# EAGLE design USB (EAGLE 4.16)
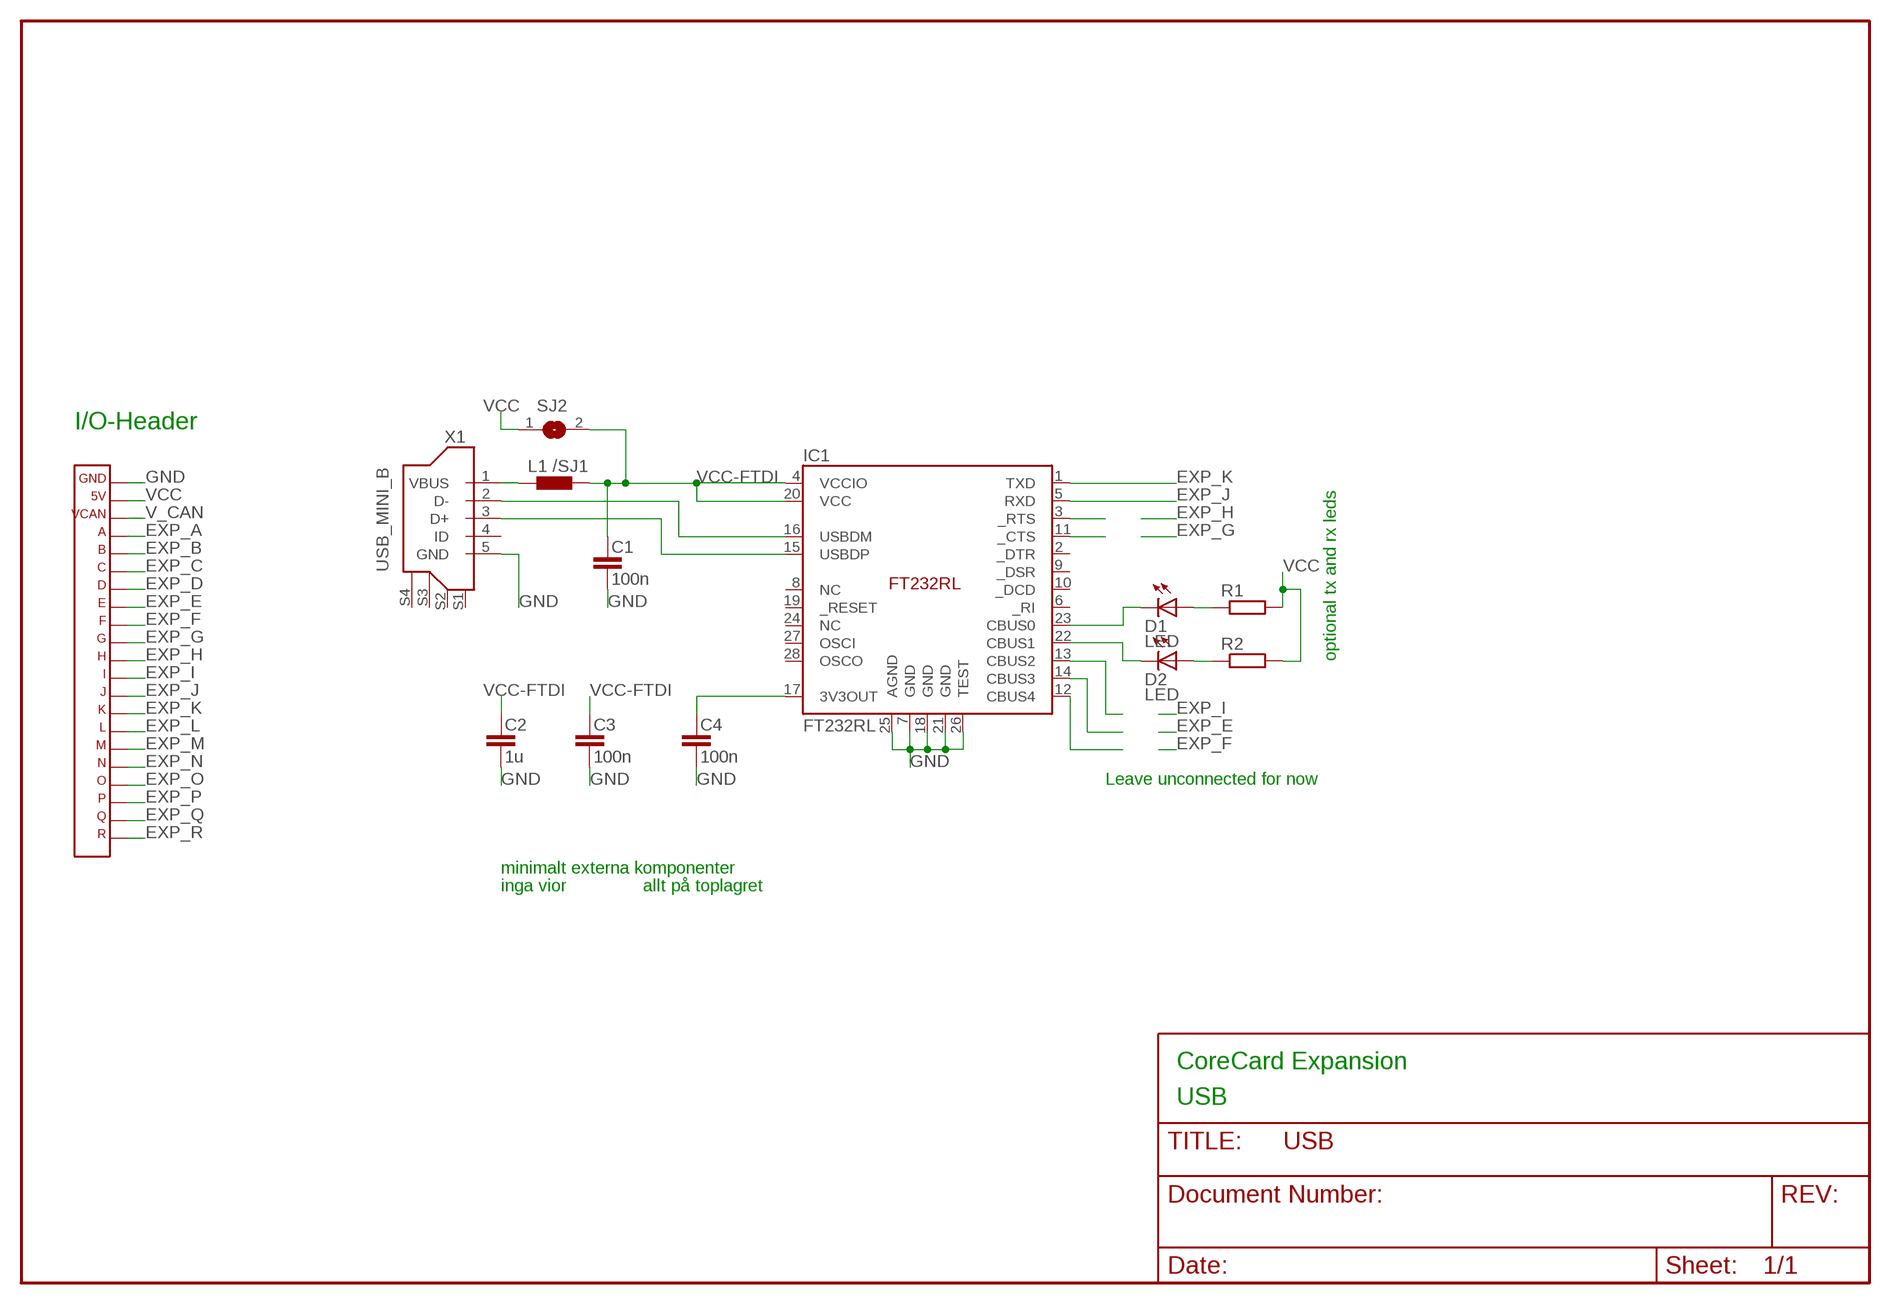
[diagram p0: schematic, sheet 1]

## Parts
C1  100n  C-EU  [C0603]
C2  1u  C-EU  [C0603]
C3  100n  C-EU  [C0603]
C4  100n  C-EU  [C0603]
D1  LED  [0603]
D2  LED  [0603]
IC1  FT232RL  [SSOP-28]
L1  L-EUL0603  [L0603]
R1  R-EUR0603  [R0603]
R2  R-EUR0603  [R0603]
SJ2  SJ_NO  [SJ_NO]
X1  USB_MINI_B  [MOLEX67503]
X3  CORE_IOHEADEXP  [CORE_IOHEAD_NOSILC]

## Nets
D+: IC1.15(USBDP) X1.3(D+)
D-: IC1.16(USBDM) X1.2(D-)
EXP_A: X3.4
EXP_B: X3.5
EXP_C: X3.6
EXP_D: X3.7
EXP_E: X3.8
EXP_F: X3.9
EXP_G: X3.10
EXP_H: X3.11
EXP_I: X3.12
EXP_J: IC1.5(RXD) X3.13
EXP_K: IC1.1(TXD) X3.14
EXP_L: X3.15
EXP_M: X3.16
EXP_N: X3.17
EXP_O: X3.18
EXP_P: X3.19
EXP_Q: X3.20
EXP_R: X3.21
GND: C1.2 C2.2 C3.2 C4.2 IC1.7(GND) IC1.18(GND) IC1.21(GND) IC1.25(AGND) IC1.26(TEST) X1.5(GND) X3.1
N$1: IC1.13(CBUS2)
N$2: IC1.14(CBUS3)
N$3: C4.1 IC1.17(3V3OUT)
N$4: IC1.11(_CTS)
N$5: IC1.3(_RTS)
N$6: D1.C IC1.23(CBUS0)
N$7: D2.C IC1.22(CBUS1)
N$8: D1.A R1.1
N$9: D2.A R2.1
N$10: IC1.12(CBUS4)
V_CAN: X3.3
VBUS: L1.1 X1.1(VBUS)
VCC: R1.2 R2.2 SJ2.1 X3.2
VCC-FTDI: C1.1 C2.1 C3.1 IC1.4(VCCIO) IC1.20(VCC) L1.2 SJ2.2
Unconnected: IC1.2(_DTR) IC1.6(_RI) IC1.8(NC) IC1.9(_DSR) IC1.10(_DCD) IC1.19(_RESET) IC1.24(NC) IC1.27(OSCI) IC1.28(OSCO) X1.4(ID) X1.S1 X1.S2 X1.S3 X1.S4

## Notes on the sheet
- I/O-Header
- /SJ1
- optional tx and rx leds
- Leave unconnected for now
- minimalt externa komponenter
- inga vior | allt på toplagret
- CoreCard Expansion
- USB

## Library data of the parts
C1-C4 = rcl:C-EU
D1 D2 = led:LED
IC1 = ftdi4:FT232RL
L1 = rcl:L-EU
R1 R2 = rcl:R-EU
SJ2 = jumper:SJ_NO
X1 = usbminib:USB_MINI_B
X3 = expboard:CORE_IOHEAD: CoreCard IO-header for expansion cards

## Board
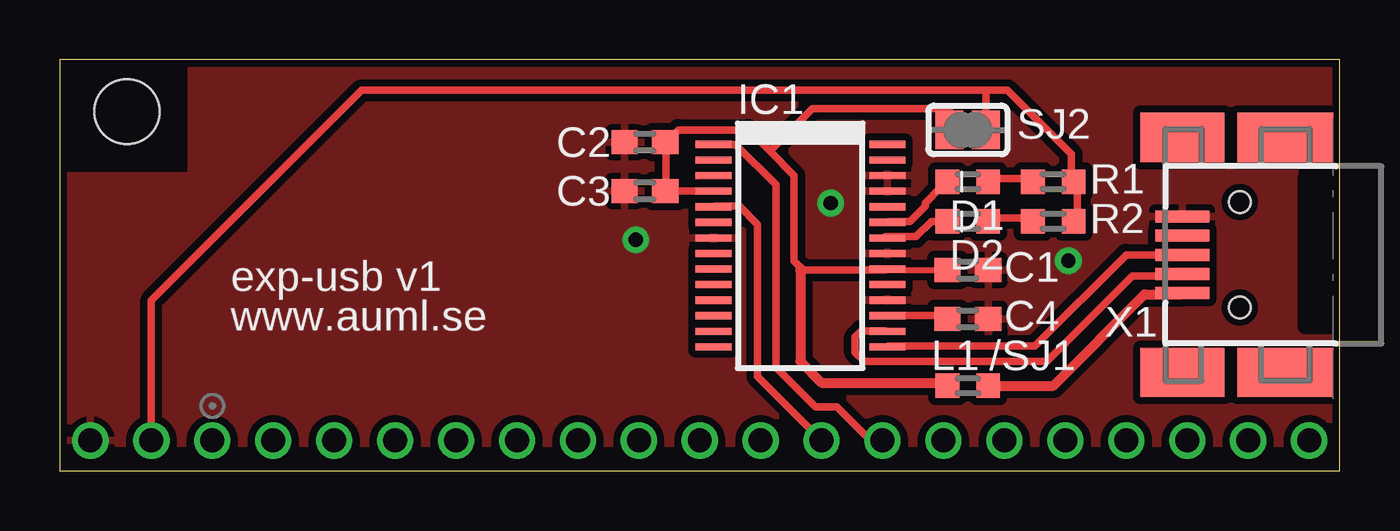
[diagram p1: board, top side]
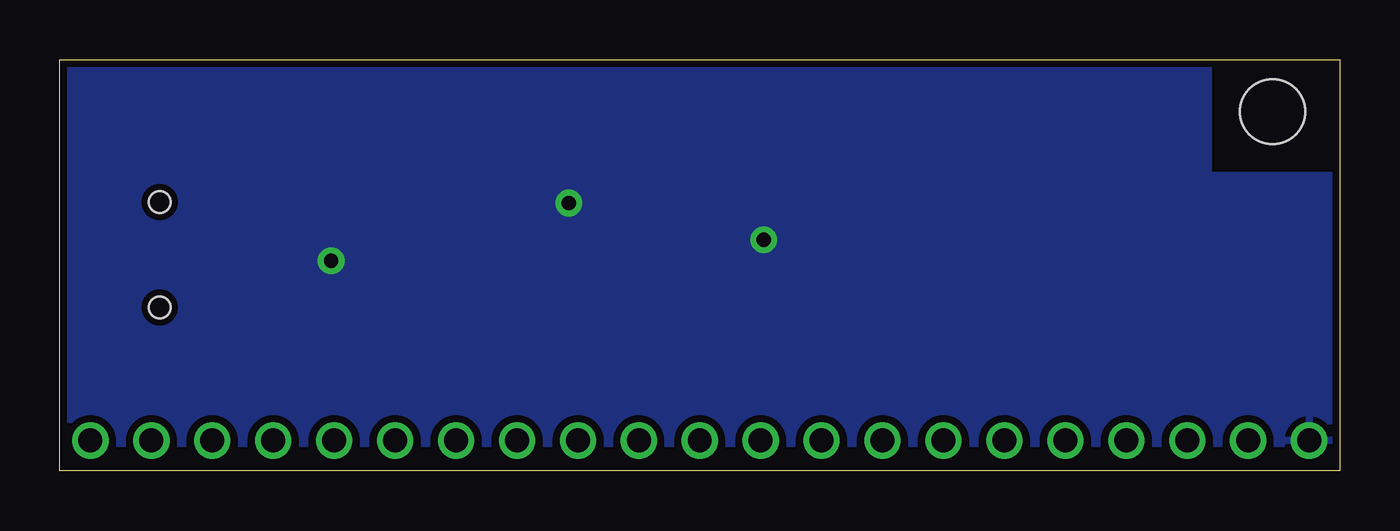
[diagram p2: board, bottom side, seen from below]

Size 53.34 x 17.14 mm. Coordinates in mm from the lower left corner, seen from the top.
Outline: 0,0 53.34,0 53.34,17.14 0,17.14 0,0
Copper layers (1*16): Top 0.035mm / dielectric 1.5mm / Bottom 0.035mm
Design rules "default": minimum track width 10mil, minimum drill 0.6mm, track to track 10mil, track to pad 10mil, pad to pad 10mil, via to via 10mil, smd to smd 8mil, copper to edge 10mil, drill to drill 8mil, minimum pad ring 10mil, minimum via ring 10mil, stop-mask expansion 4mil, vias tented up to drill 0mil, thermal gap 10mil
Holes 2.7 mm at 2.79,14.99

### Footprints (pad centres in the part's own frame; a part is rotated, then mirrored left to right if it is on the bottom)
C0603 = smd 1.1 x 1: 1 -0.85,0; 2 0.85,0
0603 = smd 0.991 x 1.016: A -0.85,0; C 0.85,0
SSOP-28 = smd 0.3 x 1.5: 1 -4.225,-3.625; 2 -3.575,-3.625; 3 -2.925,-3.625; 4 -2.275,-3.625; 5 -1.625,-3.625; 6 -0.975,-3.625; 7 -0.325,-3.625; 8 0.325,-3.625; 9 0.975,-3.625; 10 1.625,-3.625; 11 2.275,-3.625; 12 2.925,-3.625; 13 3.575,-3.625; 14 4.225,-3.625; 15 4.225,3.625; 16 3.575,3.625; 17 2.925,3.625; 18 2.275,3.625; 19 1.625,3.625; 20 0.975,3.625; 21 0.325,3.625; 22 -0.325,3.625; 23 -0.975,3.625; 24 -1.625,3.625; 25 -2.275,3.625; 26 -2.925,3.625; 27 -3.575,3.625; 28 -4.225,3.625
L0603 = smd 0.991 x 1.016: 1 -0.85,0; 2 0.85,0
R0603 = smd 0.991 x 1.016: 1 -0.85,0; 2 0.85,0
SJ_NO = smd 1.168 x 1.6: 1 -0.762,0; 2 0.762,0
MOLEX67503 = smd 2.25 x 0.5: 1 6.3,1.6; 2 6.3,0.8; 3 6.3,0; 4 6.3,-0.8; 5 6.3,-1.6 | smd 3.5 x 2.05: S1 6.3,4.9; S2 6.3,-4.9 | smd 4 x 2.05: S3 2,4.9; S4 2,-4.9 | hole 0.9: 3.9,2.2; 3.9,-2.2
CORE_IOHEAD_NOSILC = drill 1 round: 1 25.4,0; 2 22.86,0; 3 20.32,0; 4 17.78,0; 5 15.24,0; 6 12.7,0; 7 10.16,0; 8 7.62,0; 9 5.08,0; 10 2.54,0; 11 0,0; 12 -2.54,0; 13 -5.08,0; 14 -7.62,0; 15 -10.16,0; 16 -12.7,0; 17 -15.24,0; 18 -17.78,0; 19 -20.32,0; 20 -22.86,0; 21 -25.4,0

### Placement (x,y rotation side)
C1  37.85,8.38 0 top
C2  24.38,13.72 180 top
C3  24.38,11.68 180 top
C4  37.85,6.35 0 top
D1  37.85,12.06 180 top
D2  37.85,10.41 180 top
IC1  30.86,9.4 270 top
L1  37.85,3.56 180 top
R1  41.4,12.06 0 top
R2  41.4,10.41 0 top
SJ2  37.85,14.22 180 top
X1  53.09,9.02 180 top
X3  26.67,1.27 0 bottom

### Tracks (layer width: path | path; a pad name or v marks a point on that pad's centre or on a via)
D+
  Top 0.305: IC1.15 34.51,5.17 34.54,5.21 40.64,5.21 44.45,9.02 X1.3 46.86,9.02
D-
  Top 0.305: IC1.16 34.44,5.82 34.42,5.84 33.4,5.84 33.15,5.59 33.15,4.95 33.53,4.57 41.15,4.57 44.7,8.13 46.74,8.13 46.79,8.18 X1.2
EXP_J
  Top 0.305: IC1.5 27.3,11.02 27.3,11.05 28.32,11.05 29.08,10.29 29.08,3.94 X3.13
EXP_K
  Top 0.305: IC1.1 28.16,13.62 29.84,11.94 29.84,4.32 31.5,2.67 32.38,2.67 33.78,1.27 X3.14
GND  (via drill 0.6)
  other vias: 24,9.65 32.13,11.18 42.04,8.76
  pour Top (isolate 0.305): 5.46,17.02 53.21,17.02 53.21,1.14 0.13,1.14 0.13,12.32 5.46,12.32
  pour Bottom (isolate 0.305): 5.46,17.02 53.21,17.02 53.21,1.14 0.13,1.14 0.13,12.32 5.46,12.32
N$3
  Top 0.305: C4.1 36.96,6.1 36.96,6.22 36.7,6.48 IC1.17
N$6
  Top 0.305: D1.C 36.74,11.81 36.7,11.81 36.07,11.18 36.07,11.05 35.43,10.41 34.53,10.41 IC1.23
N$7
  Top 0.305: D2.C 36.32,10.41 35.69,9.78 34.43,9.78 | 34.43,9.78 34.42,9.78 | IC1.22 34.43,9.78
N$8
  Top 0.305: R1.1 40.51,12.06 40.51,12.19 38.73,12.19 38.73,12.06 D1.A
N$9
  Top 0.305: R2.1 40.51,10.41 40.51,10.54 38.73,10.54 38.73,10.41 D2.A
VBUS
  Top 0.406: X1.1 46.74,7.37 45.21,7.37 41.4,3.56 L1.1
VCC
  Top 0.305: R2.2 42.42,10.41 42.42,12.06 R1.2 42.16,12.06 42.16,13.21 39.5,15.88 38.61,15.88 | X3.2 3.81,7.11 12.57,15.88 38.61,15.88 | 38.61,15.88 SJ2.1
VCC-FTDI
  Top 0.254: IC1.4 27.29,11.67 27.3,11.68 27.18,11.68 | 34.42,8.38 34.46,8.42 IC1.20 34.5,8.42 34.54,8.38 C1.1 | 25.34,13.78 25.4,13.72 C2.1
  Top 0.305: C3.1 25.27,11.68 25.27,11.81 | 27.18,11.67 27.18,11.68 25.4,11.68 25.4,11.81 25.27,11.81 | 25.27,11.81 25.27,13.72 25.34,13.78 25.78,14.22 28.7,14.22 29.59,13.34 | 30.99,8.38 30.86,8.38 | 30.99,8.38 34.42,8.38 | 30.99,8.38 30.61,8.76 30.61,12.32 29.59,13.34 | SJ2.2 37.08,15.11 31.37,15.11 29.59,13.34
  Top 0.406: 30.86,8.38 30.86,4.57 31.75,3.68 36.96,3.68 37.08,3.43 L1.2

### Text on the board
tPlace: exp-usb v1 | www.auml.se | /SJ1
Document: If etched single layer, GNDs needs to be connected
tDocu: - | + | J | K